# Altium schematic sheet Mircod_TEST_LIST_4.SchDoc
size A4
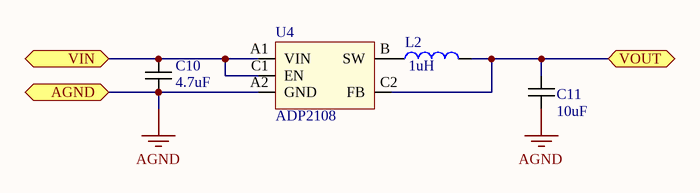
[diagram p0: Mircod_TEST_LIST_4.SchDoc]

## Parts
C10  4.7uF  [CSMD_0603]
C11  10uF  [CSMD_0603]
L2  1uH  [RDSMD_0603]
U4  ADP2108  [CB-5-3]

## Ports
AGND, VIN, VOUT

## Nets
AGND: C10.1 C11.1 U4.A2(GND) ; port AGND
VIN: C10.2 U4.A1(VIN) U4.C1(EN) ; port VIN
VOUT: C11.2 L2.1 U4.C2(FB) ; port VOUT
NetL2_2: L2.2 U4.B(SW)

## Library data of the parts
C10 C11 = C_SMD: CAPACITOR
L2 = INDUCTOR
U4 = ADP2108: Compact, 600 mA, 3 MHz,  Step-Down DC-to-DC Converter